# EAGLE design flame-rev-b (EAGLE 5.11)
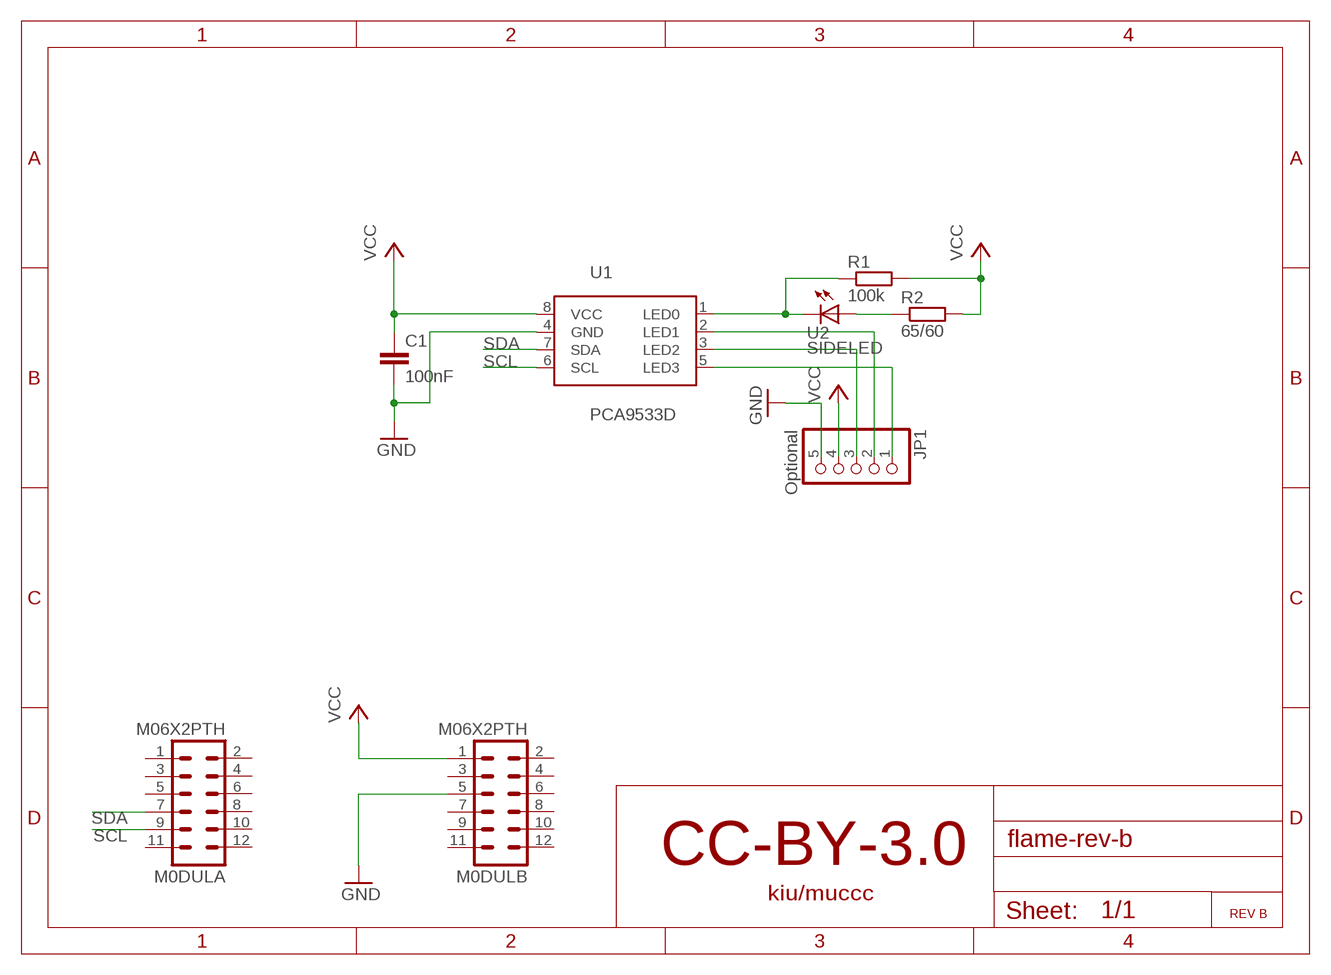
[diagram p0: schematic, sheet 1]

## Parts
C1  100nF  C-EUC0805  [C0805]
JP1  Optional  HEADER-1X5ROUND  [1X05_ROUND]
M0DULA  M06X2PTH  MA06-2  [MA06-2]
M0DULB  M06X2PTH  MA06-2  [MA06-2]
R1  100k  R-EU_R0805  [R0805]
R2  65/60  R-EU_R0805  [R0805]
U1  PCA9533D  [SO8/SOT96-1]
U2  SIDELED  [SIDELED]

## Nets
GND [GND/3V3]: C1.2 JP1.5 M0DULB.5 U1.4(GND)
N$1: R2.1 U2.A
N$2: R1.1 U1.1(LED0) U2.C
N$3: JP1.1 U1.5(LED3)
N$4: JP1.3 U1.3(LED2)
N$5: JP1.2 U1.2(LED1)
SCL: M0DULA.9 U1.6(SCL)
SDA: M0DULA.7 U1.7(SDA)
VCC: C1.1 JP1.4 M0DULB.1 R1.2 R2.2 U1.8(VCC)
Unconnected: M0DULA.1 M0DULA.2 M0DULA.3 M0DULA.4 M0DULA.5 M0DULA.6 M0DULA.8 M0DULA.10 M0DULA.11 M0DULA.12 M0DULB.2 M0DULB.3 M0DULB.4 M0DULB.6 M0DULB.7 M0DULB.8 M0DULB.9 M0DULB.10 M0DULB.11 M0DULB.12

## Notes on the sheet
- CC-BY-3.0
- kiu/muccc
- REV B

## Library data of the parts
C1 = rcl:C-EU: CAPACITOR, European symbol
JP1 = microbuilder:HEADER-1X5: PIN HEADER
M0DULA M0DULB = con-lstb:MA06-2: PIN HEADER; OC_FARNELL: unknown; OC_NEWARK: unknown
R1 R2 = rcl:R-EU_: RESISTOR, European symbol
U1 = kiu:PCA9533: PCA9533
U2 = kiu:SIDELED: Special SIDELED (DO NOT USE)

## Net classes
1 FAT: width 0.2 mm, drill 0.4 mm
2 GND/3V3: width 0.2 mm, drill 0.4 mm

## Board
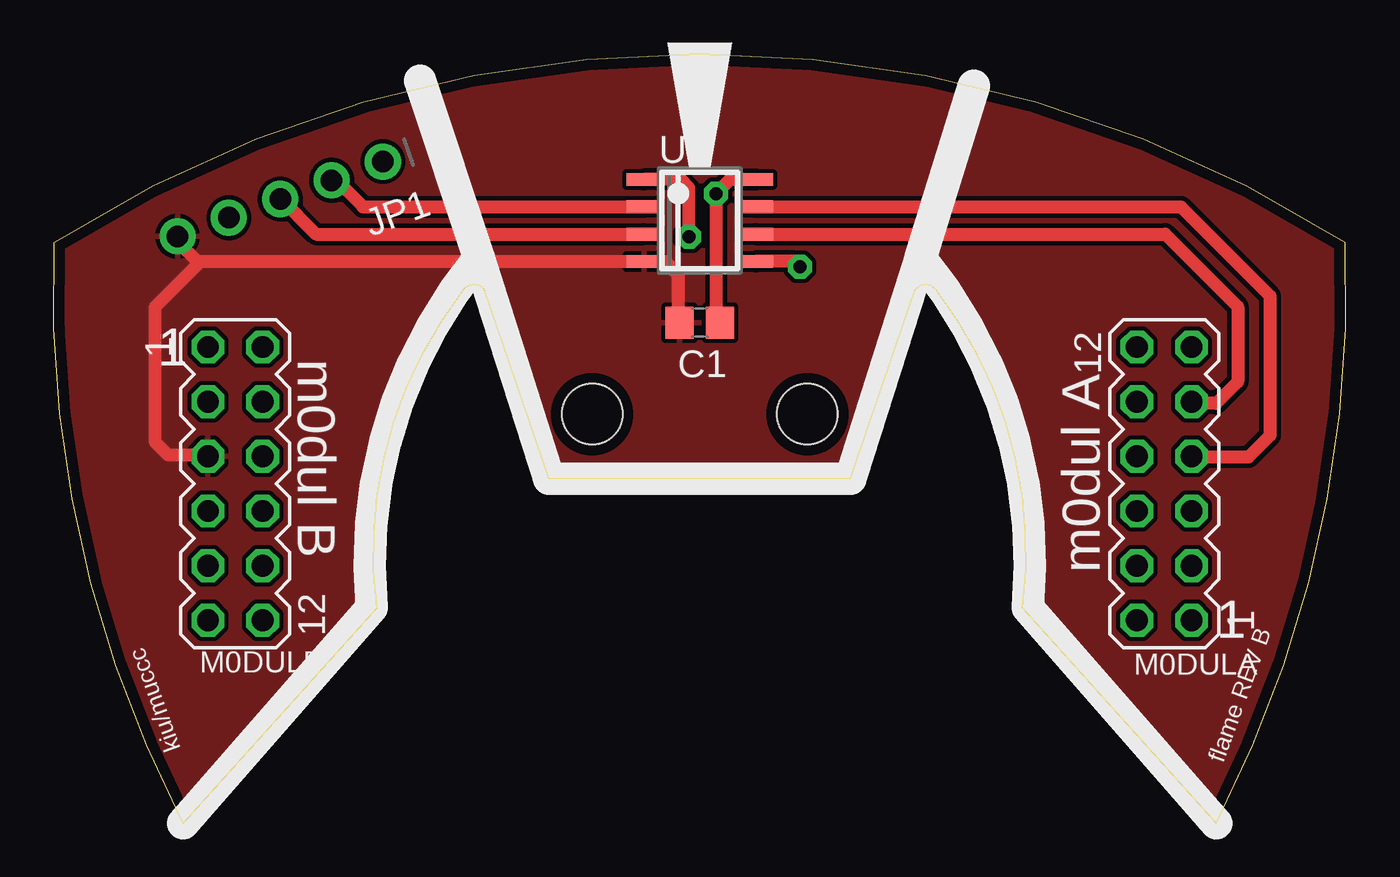
[diagram p1: board, top side]
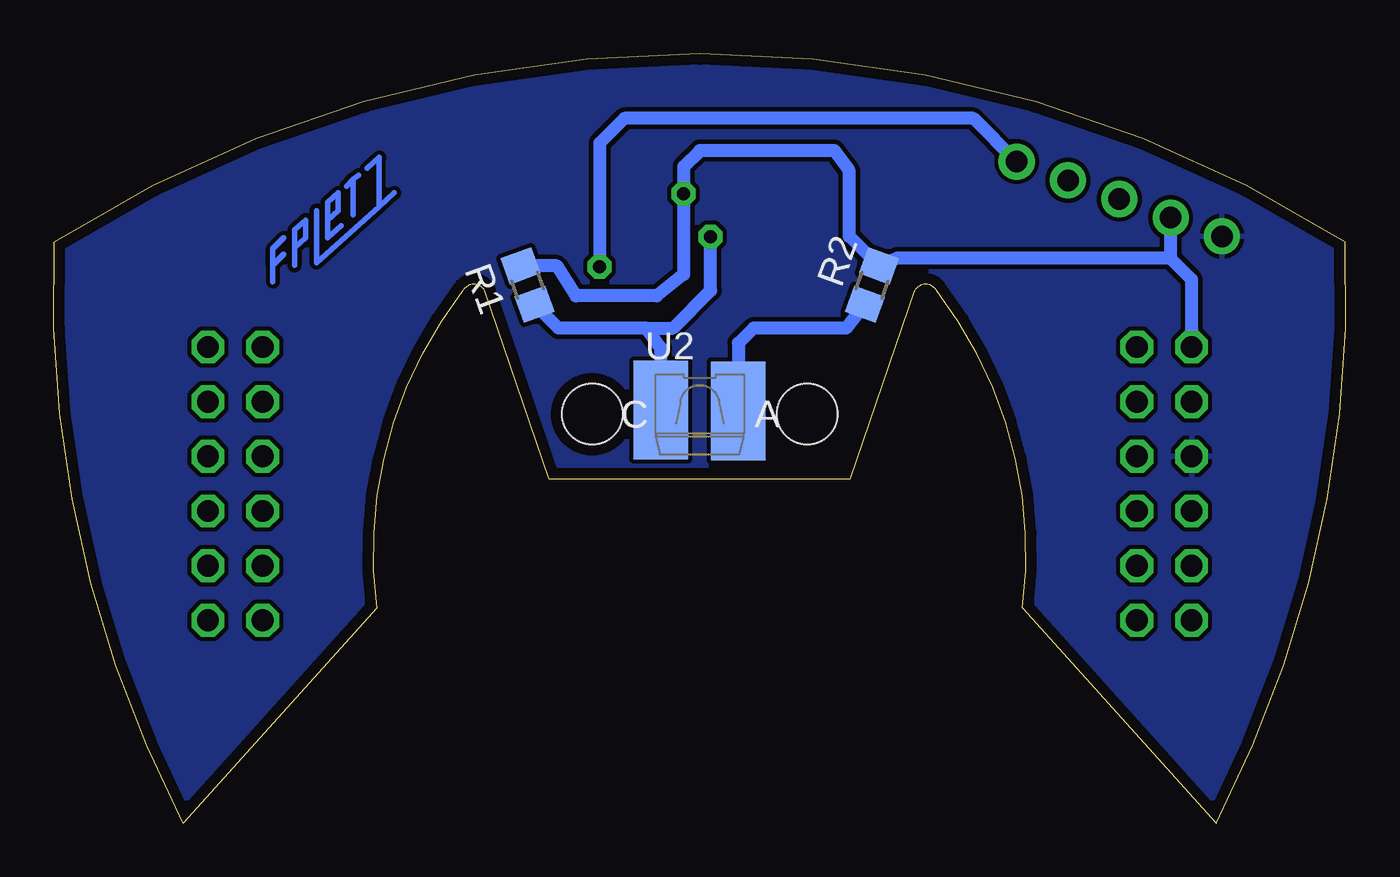
[diagram p2: board, bottom side, seen from below]

Size 60.05 x 35.74 mm. Coordinates in mm from the lower left corner, seen from the top.
Outline: 45.02,10 arc45 41.02,24.75 arc120 40.02,24.75 37.02,16 23.02,16 20.02,24.75 arc120 19.02,24.75 arc45 15.02,10 6.02,0 arc-30 0.02,27 arc-65 60.02,27 arc-30 54.02,0 45.02,10
Copper layers (1*16): Top 0.035mm / dielectric 1.5mm / Bottom 0.035mm
Design rules "PCBCart-Standard": minimum track width 8mil, minimum drill 0.4mm, track to track 8mil, track to pad 8mil, pad to pad 8mil, via to via 8mil, smd to smd 8mil, copper to edge 20mil, drill to drill 8mil, minimum pad ring 8mil, minimum via ring 10mil, stop-mask expansion 3mil, vias tented up to drill 0mil, thermal gap 8mil
Holes 2.8 mm at 25.02,19 35.02,19

### Footprints (pad centres in the part's own frame; a part is rotated, then mirrored left to right if it is on the bottom)
C0805 = smd 1.3 x 1.5: 1 -0.95,0; 2 0.95,0
1X05_ROUND = drill 1 pad 1.676 round: 1 -5.08,0; 2 -2.54,0; 3 0,0; 4 2.54,0; 5 5.08,0
MA06-2 = drill 1.016 octagon: 1 -6.35,-1.27; 2 -6.35,1.27; 3 -3.81,-1.27; 4 -3.81,1.27; 5 -1.27,-1.27; 6 -1.27,1.27; 7 1.27,-1.27; 8 1.27,1.27; 9 3.81,-1.27; 10 3.81,1.27; 11 6.35,-1.27; 12 6.35,1.27
R0805 = smd 1.3 x 1.5: 1 -0.95,0; 2 0.95,0
SO8/SOT96-1 = smd 0.6 x 1.6: 1 -1.905,-2.6; 2 -0.635,-2.6; 3 0.635,-2.6; 4 1.905,-2.6; 5 1.905,2.6; 6 0.635,2.6; 7 -0.635,2.6; 8 -1.905,2.6
SIDELED = smd 4.572 x 2.54: A -0.152,1.791; C -0.203,-1.816

### Placement (x,y rotation side)
C1  30.02,23.25 180 top
JP1  10.52,29 200 top
M0DULA  51.61,15.77 90 top
M0DULB  8.43,15.77 270 top
R1  38.02,25 110 bottom
R2  22.02,25 70 bottom
U1  30.02,28 270 top
U2  30.02,19 270 bottom

### Tracks (layer width: path | path; a pad name or v marks a point on that pad's centre or on a via)
GND
  Top 0.61: 6.75,26.02 6.82,26.09 U1.4 28.43,26.09 29.02,25.5 29.02,23.3 C1.2 | 6.75,26.02 4.72,24 4.72,17.7 5.32,17.1 7.1,17.1 M0DULB.5 | JP1.5 5.75,27.02 6.75,26.02
  pour Bottom: 60.52,-0.5 -0.48,-0.5 -0.48,36.25 60.52,36.25
  pour Top: 60.52,-0.5 -0.48,-0.5 -0.48,36.25 60.52,36.25
N$1
  Bottom 0.61: U2.A 28.22,22.3 27.52,23 23.2,23 R2.1
N$2  (via drill 0.6)
  Top 0.61: U1.1 29.12,29.91 29.52,29.5 v29.52,27.25
  Bottom 0.61: v29.52,27.25 29.52,24.75 31.27,23 32.52,23 | 32.52,23 36.59,23 R1.1 | U2.C 31.82,22.05 32.52,23
N$3  (via drill 0.6)
  Top 0.61: U1.5 34.43,26.09 v34.68,25.84
  Bottom 0.61: v34.68,25.84 34.68,31.59 33.52,32.75 17.31,32.75 JP1.1
N$4
  Top 0.61: U1.3 12.17,27.36 10.54,29 JP1.3
N$5
  Top 0.61: U1.2 14.37,28.64 13.14,29.87 JP1.2
N$11
  Bottom 0.254: 48.85,26.74 48.85,27.57 48.34,28.01 48.34,27.19 48.85,26.74 | 48.85,26.74 48.85,25.92
N$12
  Bottom 0.254: 47.84,28.46 47.84,26.04 44.91,28.65 | 45.49,30.43 44.91,30.93 44.91,28.65 | 44.91,28.65 44.22,29.28
N$13
  Bottom 0.254: 46.12,29.92 46.44,29.6 | 46.12,29.92 46.12,28.27 | 46.12,29.92 45.87,30.11
N$15
  Bottom 0.254: 46.69,27.76 47.33,27.19 47.33,28.01 | 47.33,28.01 47.33,28.84 46.82,29.28 46.82,28.46 47.33,28.01
N$19
  Bottom 0.254: 49.36,27.19 49.87,26.68 49.87,25.92 | 49.87,25.92 49.87,25.15 | 49.36,26.42 49.87,25.92
SCL
  Top 0.61: U1.6 51.66,27.36 55.02,24 55.02,20.5 54.02,19.5 52.96,19.5 M0DULA.9
SDA
  Top 0.61: U1.7 52.39,28.64 56.52,24.5 56.52,18 55.52,17 52.92,17 M0DULA.7
VCC  (via drill 0.6)
  Top 0.61: U1.8 31.43,29.91 v30.77,29.25 30.77,23.3 C1.1
  Bottom 0.61: R1.2 36.67,25.89 35.77,24.5 32.02,24.5 30.77,25.5 v30.77,29.25 30.77,30.5 30.02,31.25 23.77,31.25 23.07,30.3 23.07,27.27 R2.2 20.84,26.25 8.16,26.25 8.14,26.22 | M0DULB.1 7.16,25.25 8.14,26.22 | 8.14,26.22 JP1.4

### Text on the board
tSilkscreen: 1 | m0dul B | m0dul A | 1 | kiu/muccc | flame REV B